# EAGLE schematic exp-pins (EAGLE 9.5.2)
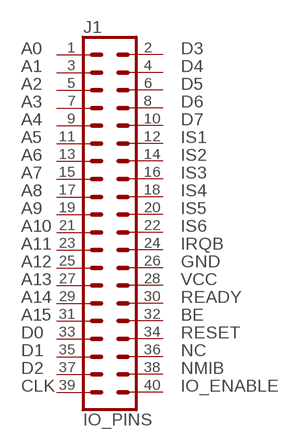
[diagram p0: schematic, sheet 1]

## Parts
J1  IO_PINS  CONN_20X2  [2X20]
Unconnected: J1.1 J1.2 J1.3 J1.4 J1.5 J1.6 J1.7 J1.8 J1.9 J1.10 J1.11 J1.12 J1.13 J1.14 J1.15 J1.16 J1.17 J1.18 J1.19 J1.20 J1.21 J1.22 J1.23 J1.24 J1.25 J1.26 J1.27 J1.28 J1.29 J1.30 J1.31 J1.32 J1.33 J1.34 J1.35 J1.36 J1.37 J1.38 J1.39 J1.40

## Notes on the sheet
- A0 | D3
- A1 | D4
- A2 | D5
- A3 | D6
- A4 | D7
- A5 | IS1
- A6 | IS2
- A7 | IS3
- A8 | IS4
- A9 | IS5
- A10 | IS6
- A11 | IRQB
- A12 | GND
- A13 | VCC
- A14 | READY
- A15 | BE
- D0 | RESET
- D1 | NC
- D2 | NMIB
- CLK | IO_ENABLE

## Library data of the parts
J1 = SparkFun-Connectors:CONN_20X2: Multi connection point. Often used as Generic Header-pin footprint for 0.1 inch spaced/style header connections On any of the 0.1 inch spaced packages, you can populate with these: Break Away Headers - Straight <https://www.sparkfun.com/products/116> (PRT-00116) Break Away Male Headers - Right Angle <https://www.sparkfun.com/products/553> (PRT-00553) Female Headers <https://www.sparkfun.com/products/115> (PRT-00115) Break Away Headers - Machine Pin <https://www.sparkfun.com/products/117> (PRT-00117) Break Away Female Headers - Swiss Machine Pin <https://www.sparkfun.com/products/743> (PRT-00743)